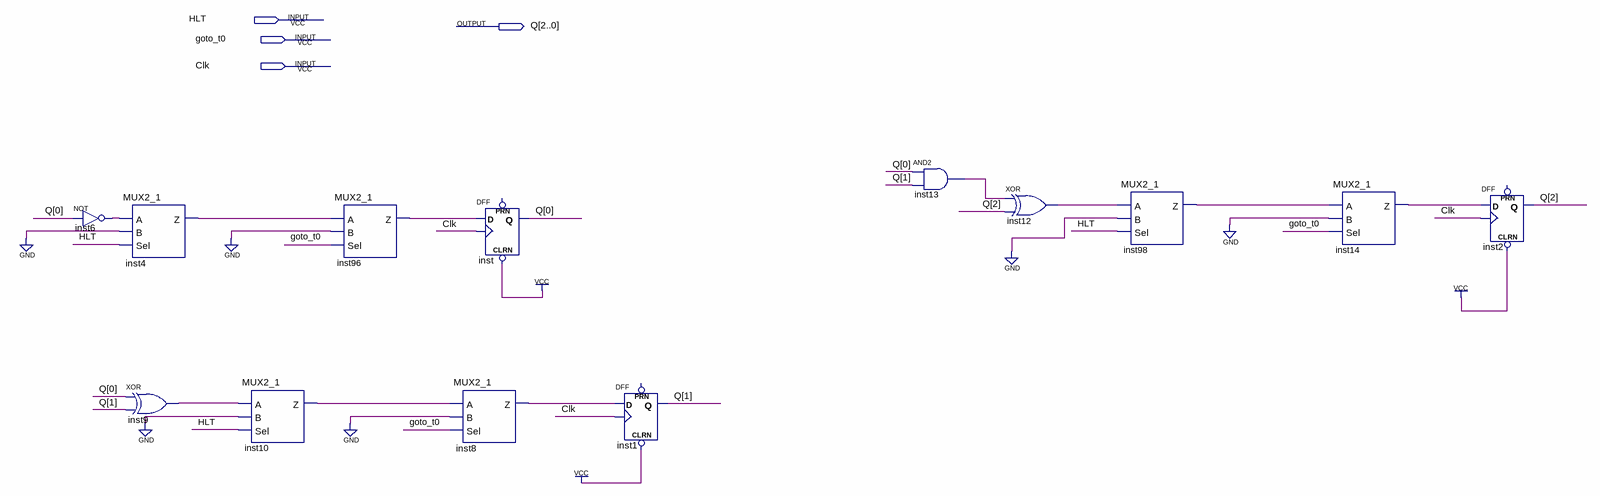
[diagram p0: schematic sheet]
// Quartus schematic SyncCounter3.bdf as structural Verilog: 13 symbols, 4 pins
module SyncCounter3 (
  input  HLT,
  input  goto_t0,
  input  Clk,
  output [2:0] Q
);

  wire inst4_z, inst6_out, inst8_z, inst9_out, inst10_z, inst12_out, inst13_out, inst14_z, inst96_z, inst98_z;

  not inst6 (inst6_out, Q[0]);
  MUX2_1 inst4 (.A(inst6_out), .B(1'b0), .Sel(HLT), .Z(inst4_z));
  xor inst9 (inst9_out, Q[0], Q[1]);
  MUX2_1 inst10 (.A(inst9_out), .B(1'b0), .Sel(HLT), .Z(inst10_z));
  MUX2_1 inst96 (.A(inst4_z), .B(1'b0), .Sel(goto_t0), .Z(inst96_z));
  MUX2_1 inst8 (.A(inst10_z), .B(1'b0), .Sel(goto_t0), .Z(inst8_z));
  DFF inst (.CLRN(1'b1), .CLK(Clk), .D(inst96_z), .Q(Q[0]));  // open: PRN
  DFF inst1 (.CLRN(1'b1), .CLK(Clk), .D(inst8_z), .Q(Q[1]));  // open: PRN
  and inst13 (inst13_out, Q[0], Q[1]);
  xor inst12 (inst12_out, inst13_out, Q[2]);
  MUX2_1 inst98 (.A(inst12_out), .B(1'b0), .Sel(HLT), .Z(inst98_z));
  MUX2_1 inst14 (.A(inst98_z), .B(1'b0), .Sel(goto_t0), .Z(inst14_z));
  DFF inst2 (.CLRN(1'b1), .CLK(Clk), .D(inst14_z), .Q(Q[2]));  // open: PRN
endmodule
